# EAGLE design bustr_0.1 (EAGLE 7.5.0)
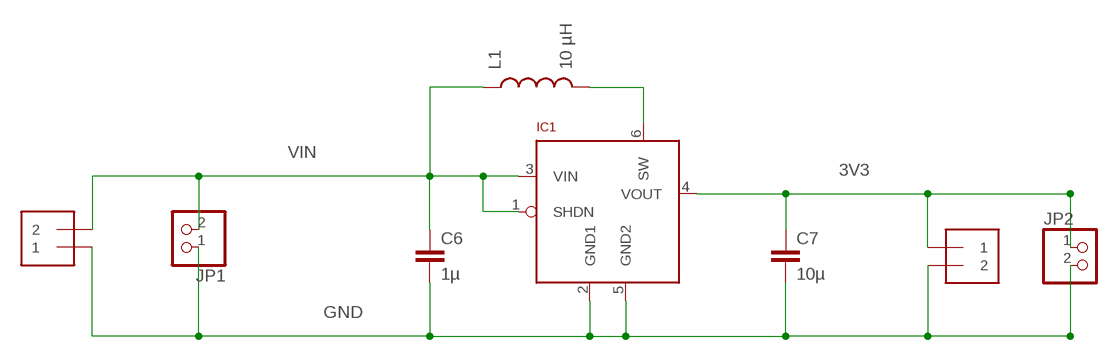
[diagram p0: schematic, sheet 1]

## Parts
C6  1µ  CAP0603-CAP  [0603-CAP]
C7  10µ  CAP0805  [0805]
IC1  LTC3525  [SC70]
JP1  PINHD-1X2  [1X02]
JP2  PINHD-1X2  [1X02]
L1  10 µH  INDUCTOR1210  [1210]
ST1  1X2-3.5MM  [1X2-3.5MM]
ST2  1X2-3.5MM  [1X2-3.5MM]

## Nets
3V3 [power]: C7.1 IC1.4(VOUT) JP2.1 ST2.1
GND: C6.2 C7.2 IC1.2(GND1) IC1.5(GND2) JP1.1 JP2.2 ST1.1 ST2.2
N$4 [power]: IC1.6(SW) L1.2
VIN [power]: C6.1 IC1.1(SHDN) IC1.3(VIN) JP1.2 L1.1 ST1.2

## Library data of the parts
C6 C7 = SparkFun:CAP: Capacitor Standard 0603 ceramic capacitor, and 0.1" leaded capacitor.
IC1 = JeeLabs:LTC3525
JP1 JP2 = pinhead:PINHD-1X2: PIN HEADER
L1 = SparkFun:INDUCTOR: Inductors Basic Inductor/Choke - 0603 and 1206. Footprints are not proven and vary greatly between part numbers.
ST1 ST2 = adafruit:1X2: 3.5mm Terminal block http://www.ladyada.net/library/pcb/eaglelibrary.html

## Net classes
1 power: width 0.305 mm, clearance 0.203 mm

## Board
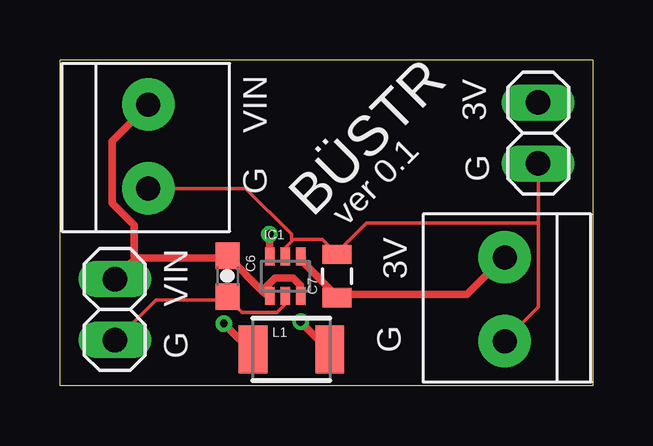
[diagram p1: board, top side]
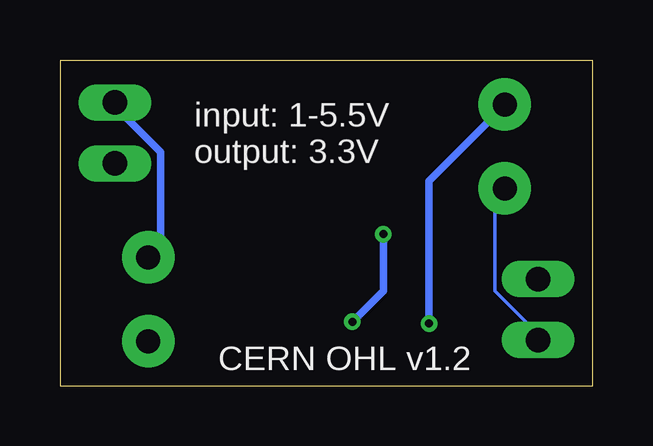
[diagram p2: board, bottom side, seen from below]

Size 22.22 x 13.59 mm. Coordinates in mm from the lower left corner, seen from the top.
Outline: 22.22,0 0,0 0,13.59 22.22,13.59 22.22,0
Copper layers (1*16): Top 0.0356mm / dielectric 1.5011mm / Bottom 0.0356mm
Design rules "LaenPCBOrder": minimum track width 6mil, minimum drill 13mil, track to track 6mil, track to pad 6mil, pad to pad 6mil, via to via 6mil, smd to smd 6mil, copper to edge 15mil, drill to drill 6mil, minimum pad ring 7mil, minimum via ring 7mil, stop-mask expansion 3mil, vias tented up to drill 0mil, thermal gap 10mil

### Footprints (pad centres in the part's own frame; a part is rotated, then mirrored left to right if it is on the bottom)
0603-CAP = smd 1.1 x 1: 1 -0.85,0; 2 0.85,0
0805 = smd 0.8 x 1.2: 1 -0.9,0; 2 0.9,0
SC70 = smd 0.4 x 0.75: 1 -0.65,-0.825; 2 0,-0.825; 3 0.65,-0.825; 4 0.65,0.825; 5 0,0.825; 6 -0.65,0.825
1X02 = drill 1.016 long: 1 -1.27,0; 2 1.27,0
1210 = smd 1.2 x 2: 1 -1.6,0; 2 1.6,0
1X2-3.5MM = drill 1 pad 2.184: 1 1.8,0; 2 -1.7,0

### Placement (x,y rotation side)
C6  6.98,4.57 270 top
C7  11.56,4.57 90 top
IC1  9.4,4.57 0 top
JP1  2.29,3.17 90 top
JP2  19.94,10.54 270 top
L1  9.65,1.52 0 top
ST1  3.68,10.03 270 top
ST2  18.54,3.56 90 top

### Tracks (layer width: path | path; a pad name or v marks a point on that pad's centre or on a via)
3V3
  Top 0.305: IC1.4 10.11,5.33 10.11,5.18 11.56,3.73 C7.1 11.63,3.81 16.97,3.81 18.49,5.33 ST2.1
  Bottom 0.305: JP2.1 19.94,11.66 18.03,9.75 18.03,5.87 18.49,5.41 ST2.1
GND
  Top 0.152: 19.94,6.78 19.94,3.28 18.57,1.91 ST2.2 | 19.94,6.78 JP2.2 | IC1.2 9.35,3.73 9.35,3.35 9.04,3.05 7.6,3.05 6.98,3.66 C6.2 6.98,3.58 4.01,3.58 2.34,1.91 JP1.1 | 9.69,6.06 9.73,6.1 10.95,6.1 11.56,5.49 C7.2 11.56,5.56 12.78,6.78 19.94,6.78 | 9.69,6.06 9.42,5.79 9.42,5.41 IC1.5 | 9.69,6.06 9.65,6.1 9.65,6.33 7.75,8.23 3.71,8.23 ST1.1
  Bottom 0.152: JP1.1 2.34,1.91 2.34,2.21 4.09,3.96 4.09,7.85 3.71,8.23 ST1.1
N$4  (via drill 0.33)
  Top 0.305: v8.74,6.33 8.74,5.41 IC1.6 | v10.03,2.67 11.18,1.52 L1.2
  Bottom 0.305: v8.74,6.33 8.74,3.96 v10.03,2.67
VIN  (via drill 0.33)
  Top 0.305: 8.43,3.96 C6.1 6.91,5.33 3.17,5.33 | 8.43,3.96 8.59,3.81 8.74,3.81 IC1.1 | 8.43,3.96 8.97,4.5 9.73,4.5 10.03,4.19 10.03,3.81 IC1.3 | JP1.2 3.17,5.33 | L1.1 7.9,1.52 v6.83,2.59 | 3.17,5.33 3.1,5.41 3.1,6.71 2.18,7.62 2.18,10.21 3.63,11.66 ST1.2
  Bottom 0.305: v6.83,2.59 6.83,8.53 3.71,11.66 ST1.2

### Text on the board
tPlace: VIN | 3V | G | G | BÜSTR | ver 0.1 | 3V | VIN | G | G
bPlace: input: 1-5.5V / output: 3.3V | CERN OHL v1.2